# EAGLE schematic untitled (EAGLE 9.5.2)
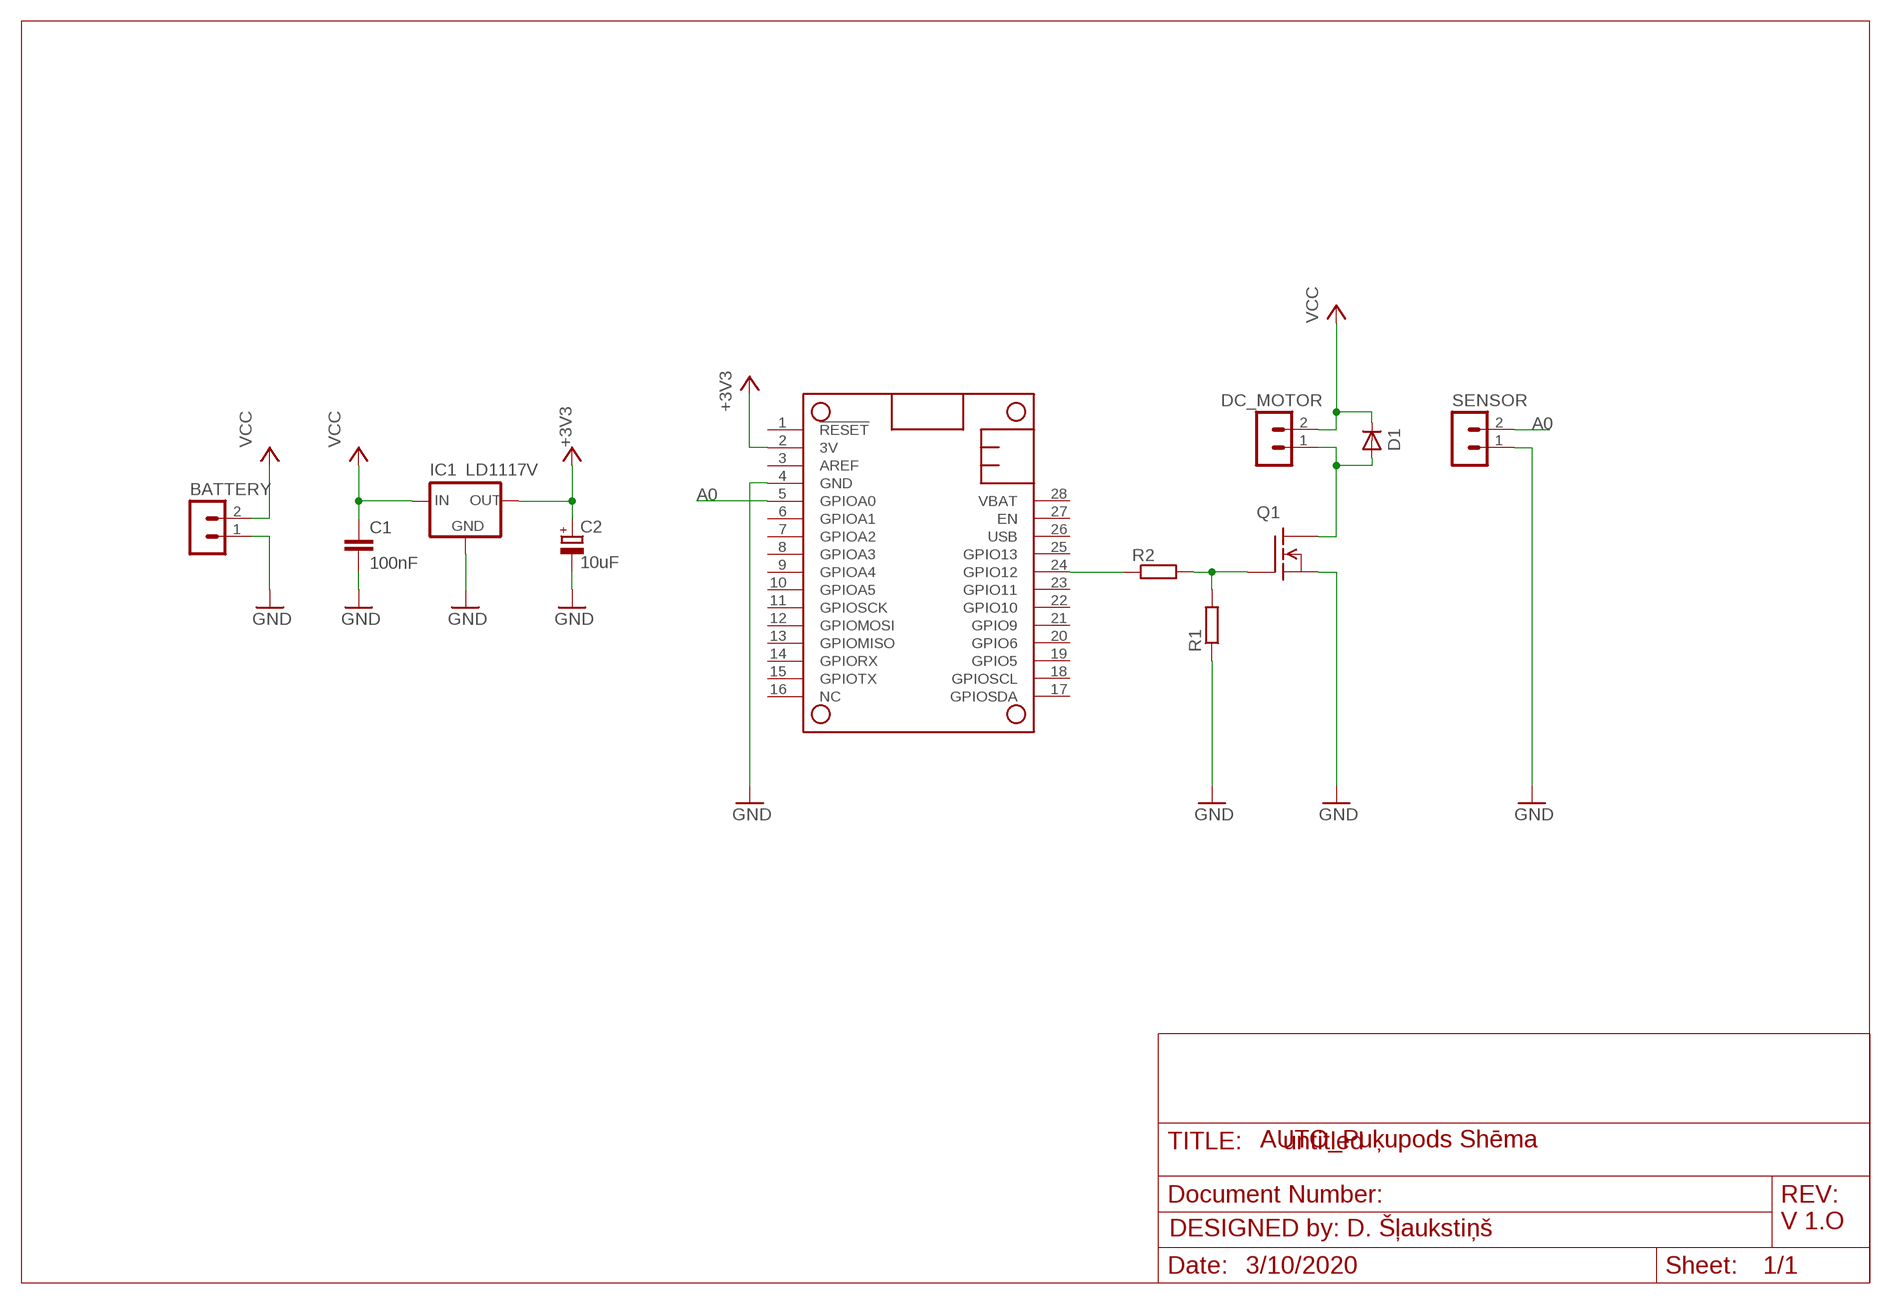
[diagram p0: schematic, sheet 1]

## Parts
BATTERY  JST02_2.54  [JST02_2.54]
C1  100nF  CAP_CERAMIC_0603  [SMD_0603C]
C2  10uF  CAP_POL_5MM  [E2,5-5]
D1  1N4004  [DO41-10]
DC_MOTOR  JST02_2.54  [JST02_2.54]
IC1  LD1117V  V_REG_LD1117VXX  [78XXL]
MS1  FEATHERWING  [FEATHERWING]
Q1  BSS97  [TO202]
R1  RESISTOR_7.5MM_HORIZONTAL  [R-7.5MM]
R2  RESISTOR_7.5MM_HORIZONTAL  [R-7.5MM]
SENSOR  JST02_2.54  [JST02_2.54]

## Nets
+3V3: C2.+ IC1.GND(OUT) MS1.2(3V)
A0: MS1.5(GPIOA0) SENSOR.2
GND: BATTERY.1 C1.2 C2.- IC1.IN(GND) MS1.4(GND) Q1.1(S) R1.1 SENSOR.1
N$1: Q1.3(G) R1.2 R2.2
N$2: MS1.24(GPIO12) R2.1
N$6: D1.A DC_MOTOR.1 Q1.2(D)
VCC: BATTERY.2 C1.1 D1.C DC_MOTOR.2 IC1.OUT(IN)
Unconnected: MS1.1(!RESET) MS1.3(AREF) MS1.6(GPIOA1) MS1.7(GPIOA2) MS1.8(GPIOA3) MS1.9(GPIOA4) MS1.10(GPIOA5) MS1.11(GPIOSCK) MS1.12(GPIOMOSI) MS1.13(GPIOMISO) MS1.14(GPIORX) MS1.15(GPIOTX) MS1.16(NC) MS1.17(GPIOSDA) MS1.18(GPIOSCL) MS1.19(GPIO5) MS1.20(GPIO6) MS1.21(GPIO9) MS1.22(GPIO10) MS1.23(GPIO11) MS1.25(GPIO13) MS1.26(USB) MS1.27(EN) MS1.28(VBAT)

## Notes on the sheet
- AUTO_Puķupods Shēma
- V 1.O
- DESIGNED by: D. Šļaukstiņš
- 3/10/2020

## Library data of the parts
BATTERY DC_MOTOR SENSOR = SIG_parts:JST02_*
C1 = SIG_parts:CAP_CERAMIC_*
C2 = SIG_parts:CAP_POL_*
D1 = adafruit:1N4004: DIODE General purpose 1N400x type rectifier (With bigger pads) http://www.ladyada.net/library/pcb/eaglelibrary.html
IC1 = SparkFun-IC-Power:V_REG_LD1117VXX: LD1117VXX voltage regulator. We carry the 3.3V version (COM-00526) in TO-220 package.
MS1 = adafruit:FEATHERWING
Q1 = transistor-fet:BSS97: N-Channel Enhancement MOSFET 200V; 1.5A; 1,6Ohm
R1 R2 = SIG_parts:RESISTOR_*